# Altium schematic sheet External_SSR.SchDoc: =SheetTitle
size A4; SheetTitle: External SSR Triggers; DrawnBy: Samyar Sadat Akhavi; DocumentNumber: 6; SheetNumber: 6; SheetTotal: 19
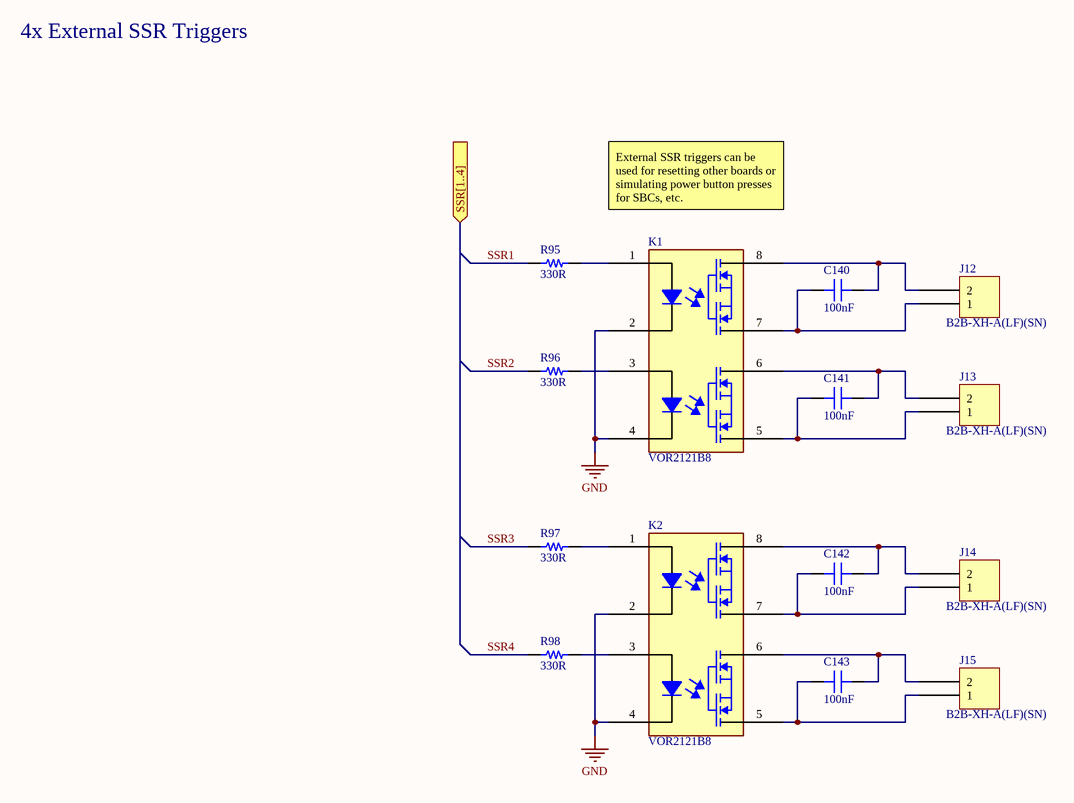
[diagram p0: External_SSR.SchDoc]

## Parts
?  (no value)  (graphical)
C140  100nF  [CAP 0603_1608]
C141  100nF  [CAP 0603_1608]
C142  100nF  [CAP 0603_1608]
C143  100nF  [CAP 0603_1608]
J12  B2B-XH-A(LF)(SN)  [JST XH B2B-XH-A]
J13  B2B-XH-A(LF)(SN)  [JST XH B2B-XH-A]
J14  B2B-XH-A(LF)(SN)  [JST XH B2B-XH-A]
J15  B2B-XH-A(LF)(SN)  [JST XH B2B-XH-A]
K1  VOR2121B8  [SMD-8_VOR2121B_VIS]
K2  VOR2121B8  [SMD-8_VOR2121B_VIS]
R95  330R  [RES 0603_1608]
R96  330R  [RES 0603_1608]
R97  330R  [RES 0603_1608]
R98  330R  [RES 0603_1608]

## Ports
SSR[1..4] (in, see Power_Board[3B], Microcontroller[3B])

## Nets
GND: K1.2 K1.4 K2.2 K2.4
SSR1: R95.1
SSR2: R96.1
SSR3: R97.1
SSR4: R98.1
NetC140_1: C140.1 J12.2 K1.8
NetC140_2: C140.2 J12.1 K1.7
NetC141_1: C141.1 J13.2 K1.6
NetC141_2: C141.2 J13.1 K1.5
NetC142_1: C142.1 J14.2 K2.8
NetC142_2: C142.2 J14.1 K2.7
NetC143_1: C143.1 J15.2 K2.6
NetC143_2: C143.2 J15.1 K2.5
NetK1_1: K1.1 R95.2
NetK1_3: K1.3 R96.2
NetK2_1: K2.1 R97.2
NetK2_3: K2.3 R98.2

## Notes on the sheet
- 4x External SSR Triggers
- External SSR triggers can be used for resetting other boards or simulating power button presses for SBCs, etc.
- Sub-Project:
- Size:
- Drawn By:
- Revision:
- Date:
- File:
- Sheet:
- of

## Library data of the parts
? = SGR-STDTBSA4: STANDARD SCHEMATICS TITLE BLOCK
C140-C143 = GEN-CC100NT10V50KX7R603: GENERIC 0603 MLC CAPACITOR; Tolerance: ±10%; Voltage: 50V; Dielectric: X7R; Part Number: GEN-CC100NT10V50KX7R603; Value: 100nF
J12-J15 = B2B-XH-A(LF)(SN): CONN HEADER VERT 2POS 2.5MM; Manufacturer: JST Sales America Inc.; Contact Length - Post: 0.134" (3.40mm); Current Rating (Amps): 3A; Material Flammability Rating: UL94 V-0; Number of Positions: 2; Number of Positions Loaded: All; Pitch - Mating: 0.098" (2.50mm); Shrouding: Shrouded - 4 Wall; Style: Board to Cable/Wire; Voltage Rating: 250V; Part Number: B2B-XH-A(LF)(SN); ComponentLink1Description: Datasheet; ComponentLink1URL: http://www.jst-mfg.com/product/pdf/eng/eXH.pdf; ComponentLink2Description: DigiKey Link; ComponentLink2URL: http://digikey.com/product-detail/en/jst-sales-america-inc/B2B-XH-A-LF-SN/455-2247-ND/1651045; Connector Type: Header; Contact Finish - Mating: Tin; Contact Finish - Post: Tin; Contact Material: Brass; Contact Shape: Square; Contact Type: Male Pin; Fastening Type: Detent Lock; Insulation Color: Natural; Insulation Height: 0.276" (7.00mm); Insulation Material: Polyamide (PA66), Nylon 6/6; LastUpdated: 1/12/2020 11:46:08 PM; Lifecycle Status: Active; Minimum Order: 1; Mounting Type: Through Hole; Number of Rows: 1; Operating Temperature: -25°C ~ 85°C; Packaging: Bulk; PartId: 67; Part Status: Active; Price: 0.15; Series: XH; Supplier 1: DigiKey; Supplier Part Number 1: 455-2247-ND; Termination: Press-Fit, Solder
K1 K2 = VOR2121B8: SSR RELAY SPST-NO 200MA 0-250V; Manufacturer: Vishay Semiconductor Opto Division; Copyright: Copyright (C) 2026 Ultra Librarian. All rights reserved.; Part Number: VOR2121B8; Supplier 1: DigiKey; Supplier Part Number 1: VOR2121B8-ND
R95-R98 = GEN-CRR330T5P8603: GENERIC 0603 CHIP RESISTOR; Tolerance: ±5%; Power: 0.125W; Part Number: GEN-CRR330T5P8603; Value: 330R